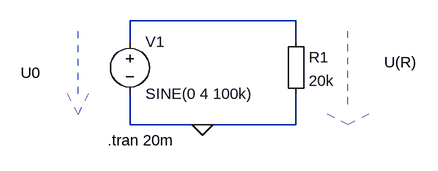
[diagram p0: schematic Versuch 2 Schaltung 3.asc]
Versuch 2 Schaltung 3.asc, the LTspice schematic file:
Version 4
SHEET 1 880 680
WIRE 480 80 224 80
WIRE 224 112 224 80
WIRE 480 112 480 80
WIRE 224 240 224 192
WIRE 336 240 224 240
WIRE 480 240 480 192
WIRE 480 240 336 240
FLAG 336 240 0
SYMBOL voltage 224 96 R0
WINDOW 123 0 0 Left 0
WINDOW 39 0 0 Left 0
SYMATTR InstName V1
SYMATTR Value SINE(0 4 100k)
SYMBOL Misc\\EuropeanResistor 464 96 R0
SYMATTR InstName R1
SYMATTR Value 20k
TEXT 190 264 Left 2 !.tran 20m
TEXT 56 160 Left 2 !U0
TEXT 616 144 Left 2 !U(R)
LINE Normal 144 192 144 96 2
LINE Normal 144 224 128 192 2
LINE Normal 160 192 144 224 2
LINE Normal 560 208 560 96 2
LINE Normal 560 240 528 224 2
LINE Normal 592 224 560 240 2

The netlist it stands for:
* Versuch 2 Schaltung 3.asc
V1 N001 0 SINE(0 4 100k)
R1 N001 0 20k
.tran 20m
U0
U(R)
.backanno
.end